# EAGLE schematic IDP (EAGLE 9.6.2)
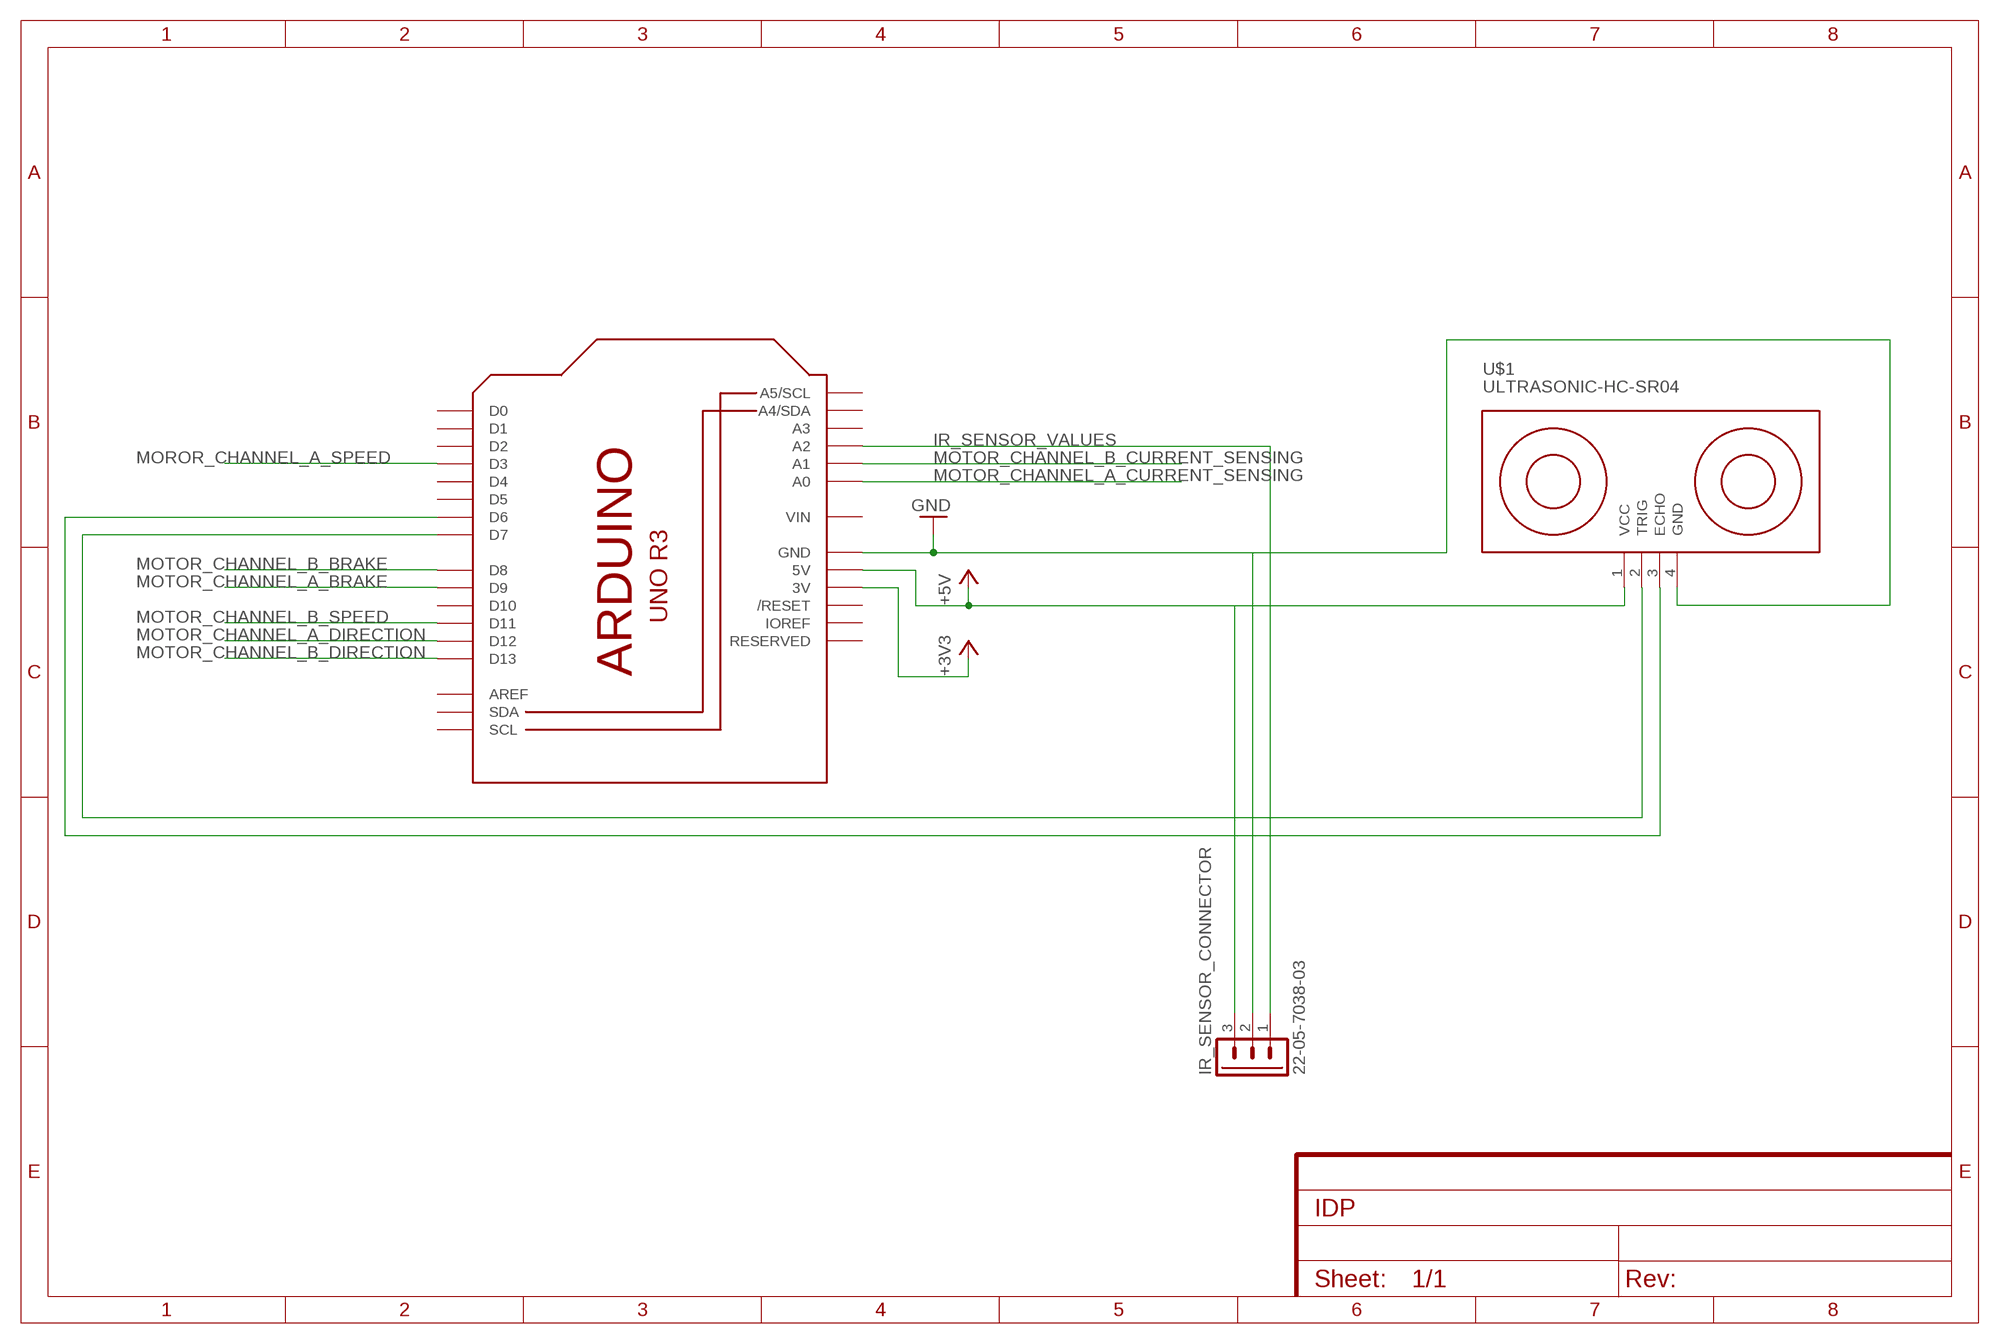
[diagram p0: schematic, sheet 1]

## Parts
IR_SENSOR_CONNECTOR  22-05-7038-03  [7395-03]
M1  IDP_PROTOBOARD  [IDP_PROTO]
U$1  ULTRASONIC-HC-SR04  [ULTRASONIC-HC-SR04]

## Nets
+3V3: M1.3V
+5V: IR_SENSOR_CONNECTOR.3 M1.5V M1.5V@0(5V) M1.5V@1(5V) M1.5V@2(5V) M1.5V@3(5V) M1.5V@4(5V) M1.5V@5(5V) M1.5V@6(5V) M1.5V@7(5V) M1.5V@8(5V) M1.5V@9(5V) M1.5V@10(5V) M1.5V@11(5V) M1.5V@12(5V) M1.5V@13(5V) M1.5V@14(5V) M1.5V@15(5V) M1.5V@16(5V) M1.5V@17(5V) M1.5V@18(5V) M1.5V@19(5V) M1.5V@20(5V) M1.5V@21(5V) M1.5V@22(5V) M1.5V@23(5V) M1.5V@24(5V) M1.5V@25(5V) M1.5V@26(5V) M1.5V@27(5V) M1.5V@28(5V) M1.5V@29(5V) M1.5V@30(5V) M1.5V@31(5V) M1.5V@32(5V) M1.5V@33(5V) M1.5V@34(5V) M1.5V@35(5V) M1.5V@36(5V) M1.5V@37(5V) M1.5V@38(5V) M1.5V@39(5V) M1.5V@40(5V) U$1.1(VCC)
ECHO: M1.D6 U$1.3(ECHO)
GND: IR_SENSOR_CONNECTOR.2 M1.GND M1.GND16(GND) M1.GND17(GND) M1.GND18(GND) M1.GND19(GND) M1.GND20(GND) M1.GND21(GND) M1.GND22(GND) M1.GND23(GND) M1.GND24(GND) M1.GND25(GND) M1.GND@1(GND) M1.GND@2(GND) M1.GND@3(GND) M1.GND@4(GND) M1.GND@5(GND) M1.GND@6(GND) M1.GND@7(GND) M1.GND@8(GND) M1.GND@9(GND) M1.GND@10(GND) M1.GND@11(GND) M1.GND@12(GND) M1.GND@13(GND) M1.GND@14(GND) M1.GND@15(GND) M1.GND@26(GND) M1.GND@27(GND) M1.GND@28(GND) M1.GND@29(GND) M1.GND@30(GND) M1.GND@31(GND) M1.GND@32(GND) M1.GND@33(GND) M1.GND@34(GND) M1.GND@35(GND) M1.GND@36(GND) M1.GND@37(GND) M1.GND@38(GND) M1.GND@39(GND) M1.GND@40(GND) M1.GND@41(GND) M1.GND@42(GND) M1.GND@43(GND) M1.GND@44(GND) M1.GND@45(GND) M1.GND@46(GND) M1.GND@47(GND) M1.GND@48(GND) U$1.4(GND)
IR_SENSOR_VALUES: IR_SENSOR_CONNECTOR.1 M1.A2
MOROR_CHANNEL_A_SPEED: M1.D3
MOTOR_CHANNEL_A_BRAKE: M1.D9
MOTOR_CHANNEL_A_CURRENT_SENSING: M1.A0
MOTOR_CHANNEL_A_DIRECTION: M1.D12
MOTOR_CHANNEL_B_BRAKE: M1.D8
MOTOR_CHANNEL_B_CURRENT_SENSING: M1.A1
MOTOR_CHANNEL_B_DIRECTION: M1.D13
MOTOR_CHANNEL_B_SPEED: M1.D11
TRIG: M1.D7 U$1.2(TRIG)
Unconnected: M1.A3 M1.A4(A4/SDA) M1.A5(A5/SCL) M1.AREF M1.D0 M1.D1 M1.D2 M1.D4 M1.D5 M1.D10 M1.IOREF M1.RESERVED M1.RESET(/RESET) M1.SCL M1.SDA M1.VIN

## Library data of the parts
IR_SENSOR_CONNECTOR = IDP_library:22-?-03: CONNECTOR wire to board 2.54 mm (.1 inch) pitch header 3 pin Right angle and straight; MF: MOLEX; OC_FARNELL: unknown; OC_NEWARK: unknown
M1 = IDP_library:IDP_PROTOBOARD
U$1 = diy-modules:ULTRASONIC-HC-SR04: Ultrasonic Ranging Module HC-SR04 More details available here: http://randomnerdtutorials.com/complete-guide-for-ultrasonic-sensor-hc-sr04/ Click here to find device on ebay.com <http://www.ebay.com/sch/hc+sr04+ultrasonic>